# Altium schematic sheet RS232_MAX3232.SchDoc
size A3
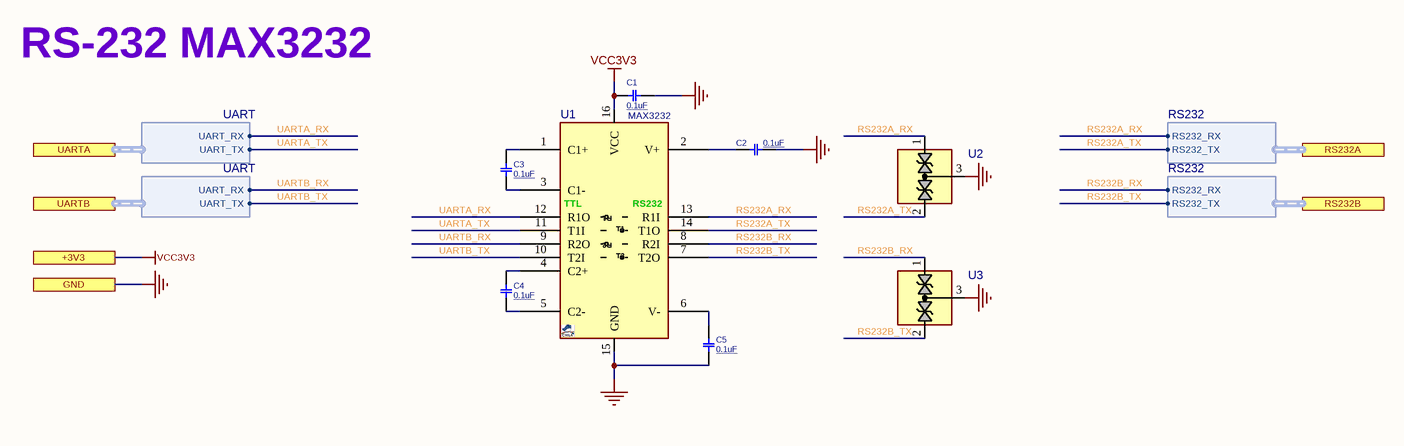
[diagram p0: RS232_MAX3232.SchDoc]

## Parts
C1  0.1uF  [C0603]
C2  0.1uF  [C0603]
C3  0.1uF  [C0603]
C4  0.1uF  [C0603]
C5  0.1uF  [C0603]
U1  MAX3232  [SO_16]
U2  CDSOT23-SM712  [SOT23_3]  (value not drawn)
U3  CDSOT23-SM712  [SOT23_3]  (value not drawn)

## Ports
+3V3, GND, RS232A (harness RS232), RS232B (harness RS232), UARTA (harness UART), UARTB (harness UART)

## Harnesses
RS232: RS232_RX, RS232_TX
UART: UART_RX, UART_TX

## Nets
GND: C1.1 C2.2 C5.2 U1.15(GND) U2.3(NC) U3.3(NC) ; port GND
VCC3V3: C1.2 U1.16(VCC) ; port +3V3
RS232A_RX: U1.13(R1I) U2.1(NC) ; port RS232A.RS232_RX
RS232A_TX: U1.14(T1O) U2.2(GND) ; port RS232A.RS232_TX
RS232B_RX: U1.8(R2I) U3.1(NC) ; port RS232B.RS232_RX
RS232B_TX: U1.7(T2O) U3.2(GND) ; port RS232B.RS232_TX
UARTA_RX: U1.12(R1O) ; port UARTA.UART_RX
UARTA_TX: U1.11(T1I) ; port UARTA.UART_TX
UARTB_RX: U1.9(R2O) ; port UARTB.UART_RX
UARTB_TX: U1.10(T2I) ; port UARTB.UART_TX
NetC2_1: C2.1 U1.2(V+)
NetC3_1: C3.1 U1.1(C1+)
NetC3_2: C3.2 U1.3(C1-)
NetC4_1: C4.1 U1.4(C2+)
NetC4_2: C4.2 U1.5(C2-)
NetC5_1: C5.1 U1.6(V-)

## Notes on the sheet
- RS-232 MAX3232
- Title
- Size:
- Date:
- A3
- Number:
- Time:
- Revision:
- Sheet
- of
- File:
- (in symbol MAX3232_SOP16) TTL; RS232; R1; R2; T1; T2

## Library data of the parts
C1-C5 = CAP_SMD_MLCC_0402: CAP, MLCC; PARAM: -, -%; MANF_P#: MANF_PART#; PARAM2: 50V; PRICE: 100= 1$; MANF: -; ASSEMBLY: ASSEMBLY; VALUE: 0.1uF
U1 = MAX3232_SOP16: RS-232, DUAL, +3~5V, Driver/Receiver, Low-Power, up to 1Mbps, Using Four 0.1µF External Capacitor; MANF_PART#: MAX3232CSE+; MANF: Maxim Integrated; PARAM2: +3~5.5V; PARAM: PARAM; VALUE: MAX3232
U2 U3 = TVS_X2_CDSOT23-SM712: TVS, ESD PROTECT, 2CH, 400W/17A PP, 7.5VBR, ±8KV ESDmin; MANF: Bourns; PARAM: 400W/17A peak-pulse; MANF_P#: CDSOT23-SM712; PARAM2: 7.5VBR, ±8KV ESD min; PRICE: 1.6$; VALUE: CDSOT23-SM712